# EAGLE design rpi-header-can-pwr (EAGLE 7.6.0)

## Sheet 1 of 6
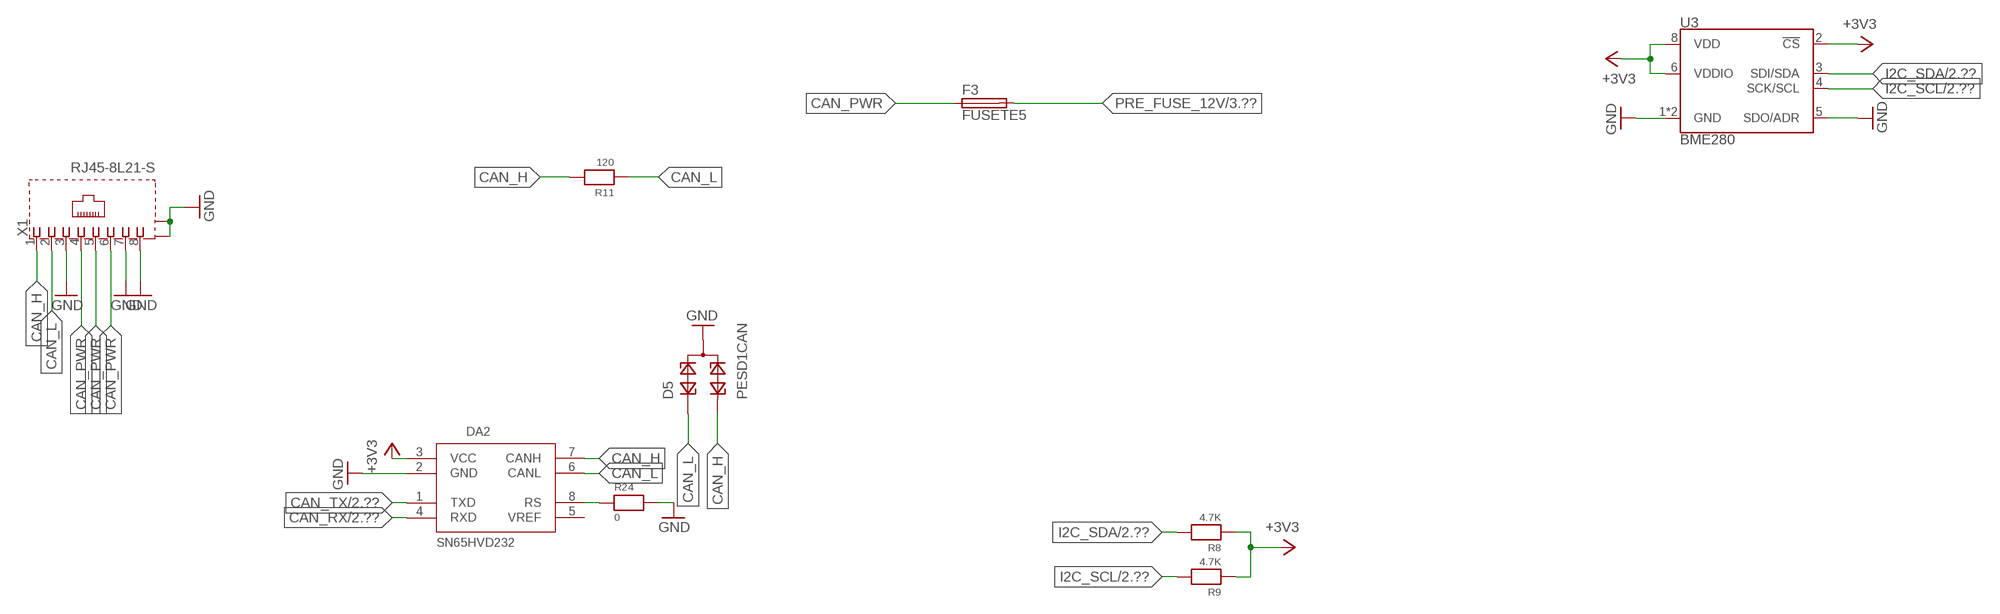
[diagram p0: schematic, sheet 1]

### Parts
D5  PESD1CAN  [SOT23]
DA2  SN65HVD232  [SO08]
F3  FUSETE5  [TE5]
R8  4.7K  RESISTOR0603  [0603]
R9  4.7K  RESISTOR0603  [0603]
R11  120  RESISTOR0603  [0603]
R24  0  RESISTOR0603  [0603]
U3  BME280  [LGA-8-2.5X2.5]
X1  RJ45-8L21-S  [RJ45-SHIELD1]

### Nets
+3V3: DA2.3(VCC) R8.1 R9.1 U3.2(!CS) U3.6(VDDIO) U3.8(VDD) ; also sheet 2,4,6
CAN_H: D5.2 DA2.7(CANH) R11.2 X1.1
CAN_L: D5.1 DA2.6(CANL) R11.1 X1.2
CAN_PWR: F3.1 X1.4 X1.5 X1.6
CAN_RX: DA2.4(RXD) ; also sheet 2
CAN_TX: DA2.1(TXD) ; also sheet 2
GND: D5.3 DA2.2(GND) R24.2 U3.1(GND) U3.5(SDO/ADR) U3.7(GND) X1.3 X1.7 X1.8 X1.S1(S) X1.S2(S) ; also sheet 2,3,4,5,6
I2C_SCL: R9.2 U3.4(SCK/SCL) ; also sheet 2,6
I2C_SDA: R8.2 U3.3(SDI/SDA) ; also sheet 2,6
N$17: DA2.8(RS) R24.1
PRE_FUSE_12V: F3.2 ; also sheet 3,5,6
Unconnected: DA2.5(VREF)

## Sheet 2 of 6
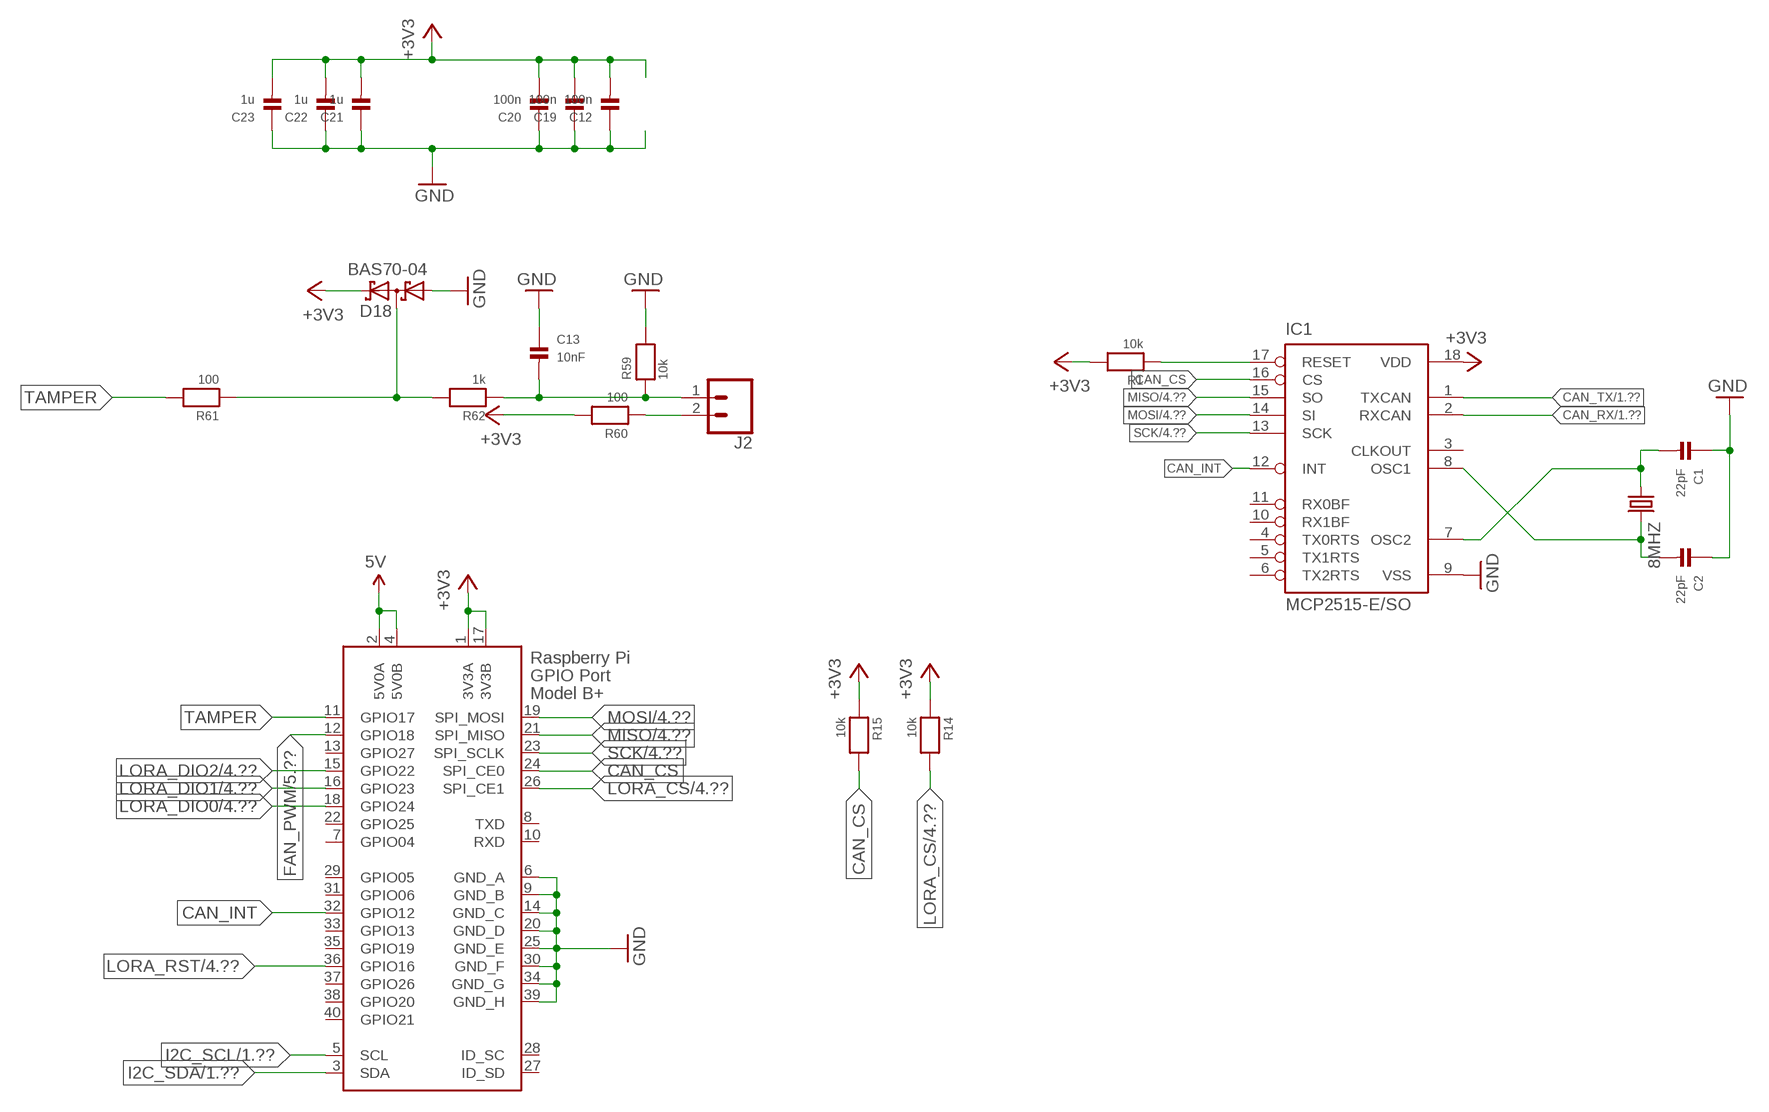
[diagram p1: schematic, sheet 2]

### Parts
8MHZ  CRYSTALHC49UP  [HC49UP]
C1  22pF  CAP_CERAMIC0603  [0603]
C2  22pF  CAP_CERAMIC0603  [0603]
C12  100n  CAP_CERAMIC0603  [0603]
C13  10nF  CAP_CERAMIC0603  [0603]
C19  100n  CAP_CERAMIC0603  [0603]
C20  100n  CAP_CERAMIC0603  [0603]
C21  1u  CAP_CERAMIC0603  [0603]
C22  1u  CAP_CERAMIC0603  [0603]
C23  1u  CAP_CERAMIC0603  [0603]
D18  BAS70-04  [SOT23]
IC1  MCP2515-E/SO  [SO18L]
J2  CONN_023.5MM  [SCREWTERMINAL-3.5MM-2]
R1  10k  RESISTOR0603  [0603]
R14  10k  RESISTOR0603  [0603]
R15  10k  RESISTOR0603  [0603]
R59  10k  RESISTOR0603  [0603]
R60  100  RESISTOR0603  [0603]
R61  100  RESISTOR0603  [0603]
R62  1k  RESISTOR0603  [0603]
X2  RASPI_BOARD_B+#_E3  [RASPI_BOARD_B+_EDGES_3DRILL]

### Nets
5V: X2.2(5V0A) X2.4(5V0B) ; also sheet 3
+3V3: C12.2 C19.2 C20.2 C21.2 C22.2 C23.2 D18.2(C2) IC1.18(VDD) R1.2 R14.1 R15.1 R60.2 X2.1(3V3A) X2.17(3V3B) ; also sheet 1,4,6
ASDASD: D18.3(C1A2) R61.1 R62.2
CAN_CS: IC1.16(CS) R15.2 X2.24(SPI_CE0)
CAN_INT: IC1.12(INT) X2.32(GPIO12)
CAN_RX: IC1.2(RXCAN) ; also sheet 1
CAN_TX: IC1.1(TXCAN) ; also sheet 1
FAN_PWM: X2.12(GPIO18) ; also sheet 5
GND: C1.1 C2.1 C12.1 C13.1 C19.1 C20.1 C21.1 C22.1 C23.1 D18.1(A1) IC1.9(VSS) R59.2 X2.6(GND_A) X2.9(GND_B) X2.14(GND_C) X2.20(GND_D) X2.25(GND_E) X2.30(GND_F) X2.34(GND_G) X2.39(GND_H) ; also sheet 1,3,4,5,6
I2C_SCL: X2.5(SCL) ; also sheet 1,6
I2C_SDA: X2.3(SDA) ; also sheet 1,6
LORA_CS: R14.2 X2.26(SPI_CE1) ; also sheet 4
LORA_DIO0: X2.18(GPIO24) ; also sheet 4
LORA_DIO1: X2.16(GPIO23) ; also sheet 4
LORA_DIO2: X2.15(GPIO22) ; also sheet 4
LORA_RST: X2.36(GPIO16) ; also sheet 4
MISO: IC1.15(SO) X2.21(SPI_MISO) ; also sheet 4
MOSI: IC1.14(SI) X2.19(SPI_MOSI) ; also sheet 4
N$2: 8MHZ.2 C2.2 IC1.8(OSC1)
N$3: 8MHZ.1 C1.2 IC1.7(OSC2)
N$10: J2.2 R60.1
N$11: C13.2 J2.1 R59.1 R62.1
RS: IC1.17(RESET) R1.1
SCK: IC1.13(SCK) X2.23(SPI_SCLK) ; also sheet 4
TAMPER: R61.2 X2.11(GPIO17)
Unconnected: IC1.3(CLKOUT) IC1.4(TX0RTS) IC1.5(TX1RTS) IC1.6(TX2RTS) IC1.10(RX1BF) IC1.11(RX0BF) X2.7(GPIO04) X2.8(TXD) X2.10(RXD) X2.13(GPIO27) X2.22(GPIO25) X2.27(ID_SD) X2.28(ID_SC) X2.29(GPIO05) X2.31(GPIO06) X2.33(GPIO13) X2.35(GPIO19) X2.37(GPIO26) X2.38(GPIO20) X2.40(GPIO21)

## Sheet 3 of 6
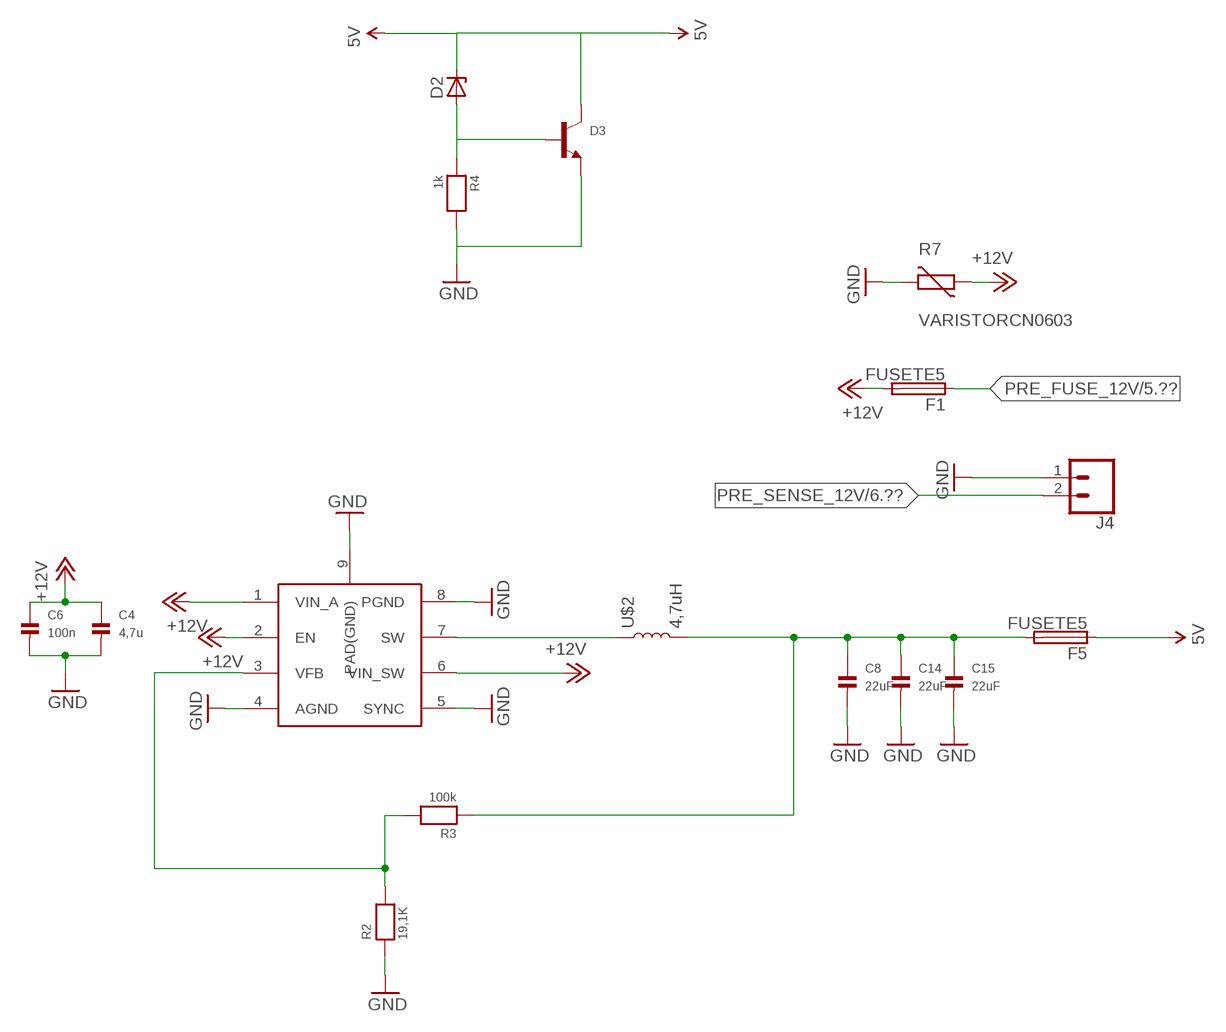
[diagram p2: schematic, sheet 3]

### Parts
C4  4,7u  CAP_CERAMIC0805  [0805]
C6  100n  CAP_CERAMIC0805  [0805]
C8  22uF  CAP_CERAMIC0805  [0805]
C14  22uF  CAP_CERAMIC0805  [0805]
C15  22uF  CAP_CERAMIC0805  [0805]
D2  ZENER-DIODESOD80C  [SOD80C]
D3  TRANSISTOR_NPNWIDE  [SOT23-WIDE]
F1  FUSETE5  [TE5]
F5  FUSETE5  [TE5]
J4  CONN_025MM  [SCREWTERMINAL-5MM-2]
R2  19,1K  RESISTOR0603  [0603]
R3  100k  RESISTOR0603  [0603]
R4  1k  RESISTOR0603  [0603]
R7  VARISTORCN0603  [CT/CN0603]
U$1  ST1S10  [POWERSO-8]
U$2  4,7uH  PCD0504MT4R7  [0504]

### Nets
5V: D2.C D3.3(C) F5.1 ; also sheet 2
+12V: C4.1 C6.1 F1.2 R7.1 U$1.1(VIN_A) U$1.2(EN) U$1.6(VIN_SW)
GND: C4.2 C6.2 C8.2 C14.2 C15.2 D3.2(E) J4.1 R2.1 R4.2 R7.2 U$1.4(AGND) U$1.5(SYNC) U$1.8(PGND) U$1.9(PAD(GND)) ; also sheet 1,2,4,5,6
N$1: R2.2 R3.2 U$1.3(VFB)
N$4: D2.A D3.1(B) R4.1
N$7: U$1.7(SW) U$2.1
N$8: C8.1 C14.1 C15.1 F5.2 R3.1 U$2.2
PRE_FUSE_12V: F1.1 ; also sheet 1,5,6
PRE_SENSE_12V: J4.2 ; also sheet 6

## Sheet 4 of 6
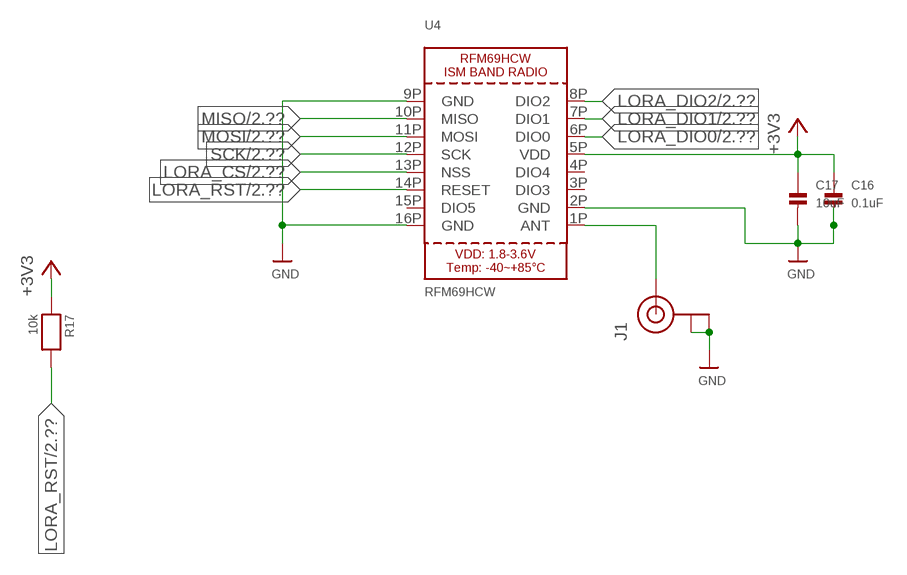
[diagram p3: schematic, sheet 4]

### Parts
C16  0.1uF  CAP_CERAMIC0603  [0603]
C17  10uF  CAP_CERAMIC0603  [0603]
J1  U.FL  [U.FL]
R17  10k  RESISTOR0603  [0603]
U4  RFM69HCW  RFM69HCW_SMT  [RFMHCW_SMT]

### Nets
+3V3: C16.1 C17.1 R17.1 U4.5P(VDD) ; also sheet 1,2,6
GND: C16.2 C17.2 J1.P$1(GND) J1.P$2(GND) U4.2P(GND) U4.9P(GND) U4.16P(GND) ; also sheet 1,2,3,5,6
LORA_CS: U4.13P(NSS) ; also sheet 2
LORA_DIO0: U4.6P(DIO0) ; also sheet 2
LORA_DIO1: U4.7P(DIO1) ; also sheet 2
LORA_DIO2: U4.8P(DIO2) ; also sheet 2
LORA_RST: R17.2 U4.14P(RESET) ; also sheet 2
MISO: U4.10P(MISO) ; also sheet 2
MOSI: U4.11P(MOSI) ; also sheet 2
N$5: J1.P$3(SIGNAL) U4.1P(ANT)
SCK: U4.12P(SCK) ; also sheet 2
Unconnected: U4.3P(DIO3) U4.4P(DIO4) U4.15P(DIO5)

## Sheet 5 of 6
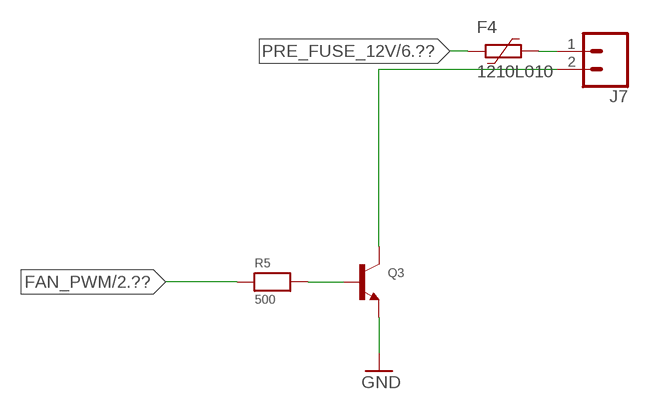
[diagram p4: schematic, sheet 5]

### Parts
F4  1210L010  [1210L]
J7  CONN_023.5MM  [SCREWTERMINAL-3.5MM-2]
Q3  TRANSISTOR_NPNWIDE  [SOT23-WIDE]
R5  500  RESISTOR0603  [0603]

### Nets
FAN_PWM: R5.1 ; also sheet 2
GND: Q3.2(E) ; also sheet 1,2,3,4,6
N$12: Q3.1(B) R5.2
N$13: F4.1 J7.1
N$14: J7.2 Q3.3(C)
PRE_FUSE_12V: F4.2 ; also sheet 1,3,6

## Sheet 6 of 6
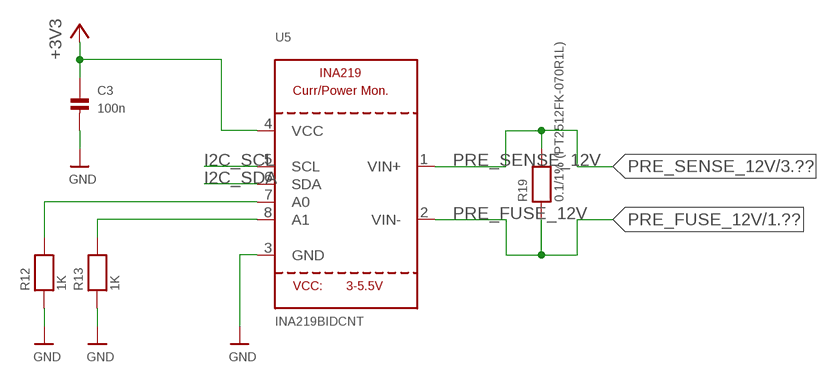
[diagram p5: schematic, sheet 6]

### Parts
C3  100n  CAP_CERAMIC0603  [0603]
R12  1K  RESISTOR0603  [0603]
R13  1K  RESISTOR0603  [0603]
R19  0.1/1% (PT2512FK-070R1L)  RESISTOR2512  [2512]
U5  INA219BIDCNT  INA219  [SOT23-8]

### Nets
+3V3: C3.1 U5.4(VCC) ; also sheet 1,2,4
GND: C3.2 R12.1 R13.1 U5.3(GND) ; also sheet 1,2,3,4,5
I2C_SCL: U5.5(SCL) ; also sheet 1,2
I2C_SDA: U5.6(SDA) ; also sheet 1,2
N$15: R13.2 U5.8(A1)
N$16: R12.2 U5.7(A0)
PRE_FUSE_12V: R19.1 U5.2(VIN-) ; also sheet 1,3,5
PRE_SENSE_12V: R19.2 U5.1(VIN+) ; also sheet 3

## Library data of the parts
8MHZ = crystal:CRYSTAL: CRYSTAL; OC_FARNELL: unknown; OC_NEWARK: unknown
C1-C4 C6 C8 C12-C17 C19-C23 = microbuilder:CAP_CERAMIC: Ceramic Capacitors 0402 - 0402 Surface Mount Capacitors 16pF 50V 5% [Digikey: 445-4899-2-ND] 18pF 50V 5% [Digikey: 490-1281-2-ND] 22pF 50V 5% [Digikey: 490-1283-2-ND] 68pF 50V 5% [Digikey: 490-1289-2-ND] 0.1uF 10V 10% [Digikey: 490-1318-2-ND] 1.0uF 6.3V 10% [Digikey: 490-1320-2-ND] 0603 - 0603 Surface Mount Capacitors 16 pF 50V 5% [Digikey: 445-5051-2-ND] 22 pF 50V [Digikey: PCC220ACVTR-ND] 33 pF 50V 5% [Digikey: 490-1415-1-ND] 56pF 50V 5% [Digikey: 490-1421-1-ND] 220pF 50V 5% [Digikey: 445-1285-1-ND] 680 pF 50V 2200 pF 50V 5% C0G [Digikey: 445-1297-1-ND] 5600 pF 100V 5% X7R [Digikey: 478-3711-1-ND] 0.1 µF 25V 10% [Digikey: PCC2277TR-ND] 0.22 µF 16V 10% X7R [Digikey: 445-1318-1-ND] 1.0 µF 25V 10% [Digikey: 445-5146-2-ND] 0603 - RF Specific 3pF 250V +/-0.1pF RF [Digikey: 712-1347-1-ND] 18 pF 250V 5% [Digikey: 478-3505-1-ND or 712-1322-1-ND] 56 pF 250V 5% C0G RF [Digikey: 490-4867-1-ND] 68 pF 250V RF [Digikey: 490-4868-1-ND] 0805 - 0805 Surface Mount Capacitors 220 pF 250V 2% RF Ceramic Capacitor [Digikey: 712-1398-1-ND] 1000 pF 50V 2% NP0 Ceramic Capacitor [Digikey: 478-3760-1-ND] 0.1 µF 25V 10% Ceramic Capacitor [Digikey: PCC1828TR-ND] 1.0 µF 16V 10% Ceramic Capacitor[Digikey: 490-1691-2-ND] 10.0 µF 10V 10% Ceramic Capacitor[Digikey: 709-1228-1-ND] 10.0 uF 16V 10% Ceramic Capacitor [Digikey: 478-5165-2-ND] 47 uF 6.3V 20% Ceramic Capacitor [Digikey: 587-1779-1-ND or 399-5506-1-ND] 1206 - 1206 Surface Mount Capacitors 47uF 10V 20% Ceramic Capacitor [Digikey: 490-5528-1-ND or 399-5508-1-ND or 445-6010-1-ND] 100uF 6.3V -20%, +80% Y5V Ceramic Capacitor (Digikey: 490-4512-1-ND, Mouser: 81-GRM31CF50J107ZE1L)
D2 = diode:ZENER-DIODE: Z-Diode
D3 Q3 = microbuilder:TRANSISTOR_NPN: NPN Transistor Transistor (NPN) 500mA 45V - BC817 [Digikey: 568-1631-1-ND] Transistor (NPN) 500mA 45V - BC817,215 [Mouser: 771-BC817-T/R] SOT23-R - SOT23 footprint optimised for use with solder paste and reflow ovens. SOT23-W - SOT23 footprint optimised for hand-soldering (larger pads).
D5 = diode:PESD1CAN: CAN bus ESD protection diode Source: http://www.nxp.com/documents/data_sheet/PESD1CAN.pdf
D18 = diode:BAS70-04: Silicon Schottky Diodes General-purpose diode for high-speed switching
DA2 = transceiver:SN65HVD232: CAN TRANSCEIVER
F1 F3 F5 = fuse:FUSE: Fuse; OC_FARNELL: unknown; OC_NEWARK: unknown
F4 = polyfuse-smd_10:?: Polyfuse Resettable PTC Source: http://www.littelfuse.com/products/resettable-ptcs.aspx; MF: Littelfuse; MPN: 1210L010; OC_FARNELL: 1822206; OC_NEWARK: 18M4781
IC1 = mcp2515:MCP2515
J1 = SparkFun-Connectors:U.FL: SMD Antenna Connector - U.FL 2mm height, 3.0mm x 3.0mm receptacle size. SparkFun Products: SparkFun WiFi Shield - ESP8266 <https://www.sparkfun.com/products/13287> SparkFun ESP8266 Thing <https://www.sparkfun.com/products/13231> SparkFun MiniGen - Pro Mini Signal Generator Shield <https://www.sparkfun.com/products/11420>; PROD_ID: CONN-09193; SF_ID: WRL-09144
J2 J7 = SparkFun-Connectors:CONN_02: Multi connection point. Often used as Generic Header-pin footprint for 0.1 inch spaced/style header connections On any of the 0.1 inch spaced packages, you can populate with these: Break Away Headers - Straight <https://www.sparkfun.com/products/116> (PRT-00116) Break Away Male Headers - Right Angle <https://www.sparkfun.com/products/553> (PRT-00553) Female Headers <https://www.sparkfun.com/products/115> (PRT-00115) Break Away Headers - Machine Pin <https://www.sparkfun.com/products/117> (PRT-00117) Break Away Female Headers - Swiss Machine Pin <https://www.sparkfun.com/products/743> (PRT-00743) For SCREWTERMINALS and SPRING TERMINALS visit here: Screw Terimnals on SparkFun.com <https://www.sparkfun.com/search/results?term=Screw+Terminals> (5mm/3.5mm/2.54mm spacing) This device is also useful as a general connection point to wire up your design to another part of your project. Our various solder wires solder well into these plated through hole pads. Hook-Up Wire - Assortment (Stranded, 22 AWG) <https://www.sparkfun.com/products/11375> (PRT-11375) Hook-Up Wire - Assortment (Solid Core, 22 AWG) <https://www.sparkfun.com/products/11367> (PRT-11367) View the entire wire category on our website here <https://www.sparkfun.com/categories/141> Special notes: Molex polarized connector foot print use with: PRT-08233 with associated crimp pins and housings. 2.54_SCREWTERM for use with PRT-10571. 3.5mm Screw Terminal footprints for PRT-08084 5mm Screw Terminal footprints for use with PRT-08432; PROD_ID: CONN-08399
J4 = SparkFun-Connectors:CONN_02: Multi connection point. Often used as Generic Header-pin footprint for 0.1 inch spaced/style header connections On any of the 0.1 inch spaced packages, you can populate with these: Break Away Headers - Straight <https://www.sparkfun.com/products/116> (PRT-00116) Break Away Male Headers - Right Angle <https://www.sparkfun.com/products/553> (PRT-00553) Female Headers <https://www.sparkfun.com/products/115> (PRT-00115) Break Away Headers - Machine Pin <https://www.sparkfun.com/products/117> (PRT-00117) Break Away Female Headers - Swiss Machine Pin <https://www.sparkfun.com/products/743> (PRT-00743) For SCREWTERMINALS and SPRING TERMINALS visit here: Screw Terimnals on SparkFun.com <https://www.sparkfun.com/search/results?term=Screw+Terminals> (5mm/3.5mm/2.54mm spacing) This device is also useful as a general connection point to wire up your design to another part of your project. Our various solder wires solder well into these plated through hole pads. Hook-Up Wire - Assortment (Stranded, 22 AWG) <https://www.sparkfun.com/products/11375> (PRT-11375) Hook-Up Wire - Assortment (Solid Core, 22 AWG) <https://www.sparkfun.com/products/11367> (PRT-11367) View the entire wire category on our website here <https://www.sparkfun.com/categories/141> Special notes: Molex polarized connector foot print use with: PRT-08233 with associated crimp pins and housings. 2.54_SCREWTERM for use with PRT-10571. 3.5mm Screw Terminal footprints for PRT-08084 5mm Screw Terminal footprints for use with PRT-08432; SF_SKU: PRT-08432
R1-R5 R8 R9 R11-R15 R17 R19 R24 R59-R62 = microbuilder:RESISTOR: Resistors 0402 - 0402 Surface Mount Package 22 Ohm 1% 1/16W [Digikey: 311-22.0LRTR-ND] 33 Ohm 5% 1/16W 1.0K 5% 1/16W 1.5K 5% 1/16W 2.0K 1% 1/16W 10.0K 1% 1/16W [Digikey: 311-10.0KLRTR-ND] 10.0K 5% 1/16W [Digikey: RMCF0402JT10K0TR-ND] 12.1K 1% 1/16W [Digikey: 311-22.0LRTR-ND] 100.0K 5% 1/16W 0603 - 0603 Surface Mount Package 0 Ohm 1/10 Watt 1% Resistor 15 Ohm 1/10 Watt 1% Resistor 33 Ohm 1/10 Watt 1% Resistor 49.9 Ohm 1/10 Watt 1% Resistor 100 Ohm 1/10 Watt 1% Resistor 150 Ohm 1/10 Watt 1% Resistor 240 Ohm 1/10 Watt 1% Resistor 390 Ohm 1/10 Watt 1% Resistor 560 Ohm 1/10 Watt 1% Resistor 680 Ohm 1/10 Watt 1% Resistor 750 Ohm 1/10 Watt 1% Resistor 1.0K Ohm 1/10 Watt 1% Resistor 1.5K Ohm 1/10 Watt 1% Resistor 2.0K Ohm 1/10 Watt 1% Resistor 2.2K Ohm 1/10 Watt 1% Resistor 3.3K Ohm 1/10 Watt 1% Resistor 4.7K Ohm 1/10 Watt 1% Resistor 10.0K Ohm 1/10 Watt 1% Resistor 12.0K Ohm 1/10 Watt 1% Resistor 12.1K Ohm 1/10 Watt 1% Resistor 20.0K Ohm 1/10 Watt 1% Resistor 33.0K Ohm 1/10 Watt 1% Resistor 100.0K Ohm 1/10 Watt 1% Resistor 0805 - 0805 Surface Mount Package 0 Ohm 1/8 Watt 1% Resistor 33 Ohm 1/8 Watt 1% Resistor 100 Ohm 1/8 Watt 1% Resistor 150 Ohm 1/8 Watt 1% Resistor 200 Ohm 1/8 Watt 1% Resistor 240 Ohm 1/8 Watt 1% Resistor 330 Ohm 1/8 Watt 1% Resistor 390 Ohm 1/8 Watt 1% Resistor 470 Ohm 1/8 Watt 1% Resistor 1.0K Ohm 1/8 Watt 1% Resistor 1.5K Ohm 1/8 Watt 1% Resistor 2.0K Ohm 1/8 Watt 1% Resistor 4.7K Ohm 1/8 Watt 1% Resistor 5.1K Ohm 1/8 Watt 1% Resistor 5.6K Ohm 1/8 Watt 1% Resistor 10.0K Ohm 1/8 Watt 1% Resistor 22.0K Ohm 1/8 Watt 1% Resistor 33.0K Ohm 1/8 Watt 1% Resistor 100K Ohm 1/8 Watt 1% Resistor 1206 - 1206 Surface Mount Package 2012 - 2010 Surface Mount Package 0.11 Ohm 1/2 Watt 1% Resistor - Digikey: RHM.11UCT-ND
R7 = varistor:VARISTOR: VARISTOR
U3 = SparkFun-Sensors:BME280: Bosch BME280 – Combined Humidity and Pressure Sensor The BME280 is as combined digital humidity, pressure and temperature sensor based on proven sensing principles. The sensor module is housed in an extremely compact metal-lid LGA package with a footprint of only 2.5×2.5mm² with a height of 0.93mm. Its small dimensions and its low power consumption allow the implementation in battery driven devices such as handsets, GPS modules or watches. Datasheet <https://cdn.sparkfun.com/assets/learn_tutorials/4/1/9/BST-BME280_DS001-10.pdf> SparkFun Products SparkFun Atmospheric Sensor Breakout - BME280 <https://www.sparkfun.com/products/13676> (SEN-13676); PROD_ID: IC-13090
U4 = microbuilder:RFM69HCW: RFM69HCW - ISM Band RF Transceiver
U5 = microbuilder:INA219: INA219 - I2C Current/Power Monitor Voltage Range: 0-26V Accuracy: 0.5% Temperature: -40°C - 125°C
U$1 = lcd:ST1S10
U$2 = lcd:PCD0504MT4R7
X1 = con-tycoelectronics:RJ45*2: RJ45 Low Profile Shield Type 2 For all RJ45 L, LC, LCT and X Series Models Source: www.tycoelectronics.com .. ENG_DS_1654001_1099_RJ_L_0507.pdf; OC_FARNELL: unknown; OC_NEWARK: unknown
X2 = raspberrypi_bastelstube_v13:RASPI_BOARD_B+#: Raspberry Pi GPIO connector with markings for the outer dimensions of the Raspberry Pi board model B+ with different sets of drill holes or mounting pads All pins connected

## Board
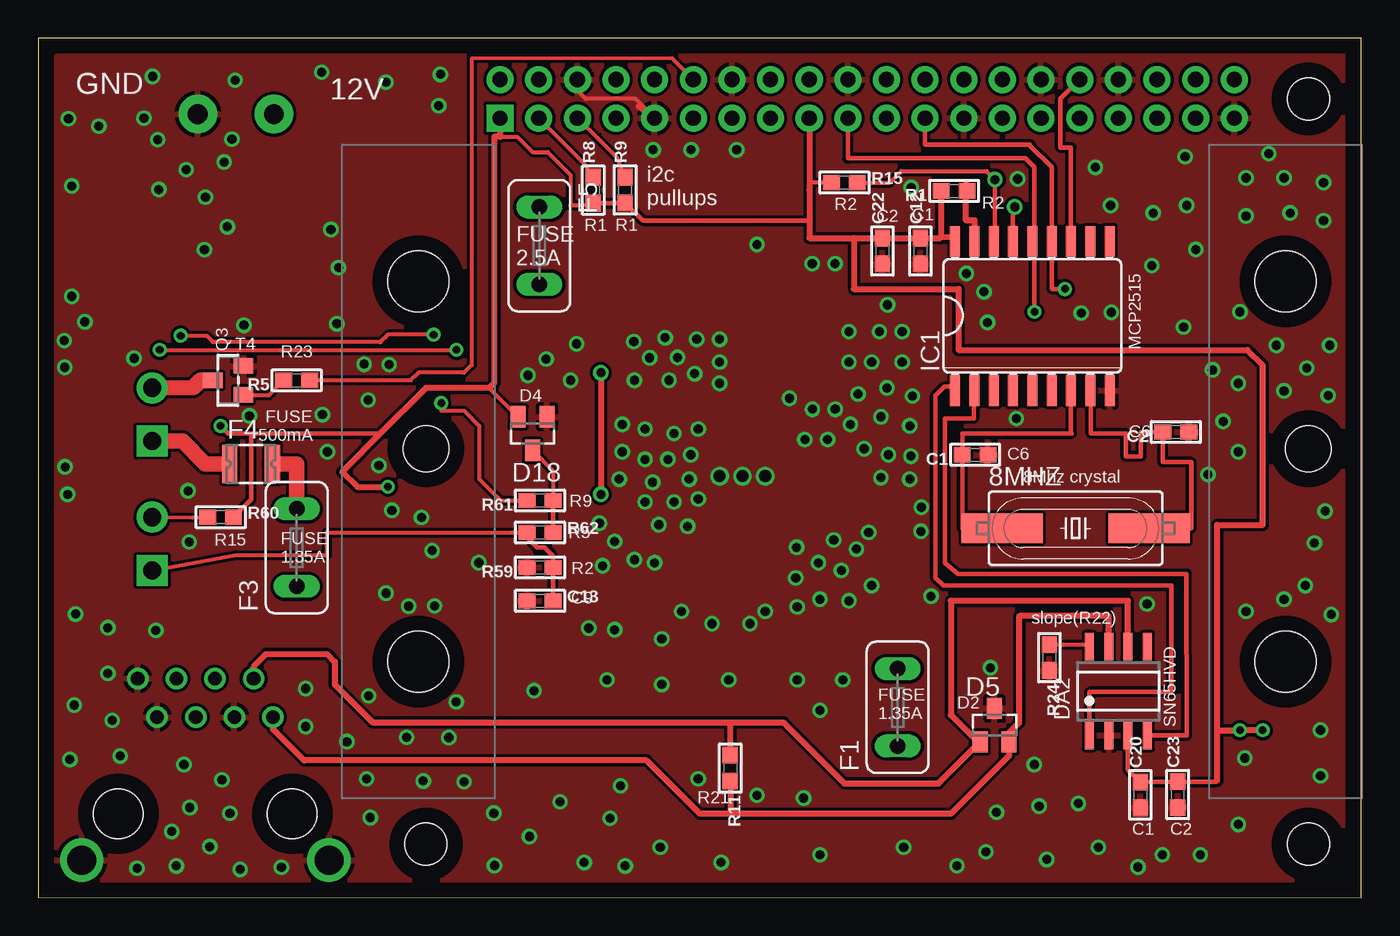
[diagram p6: board, top side]
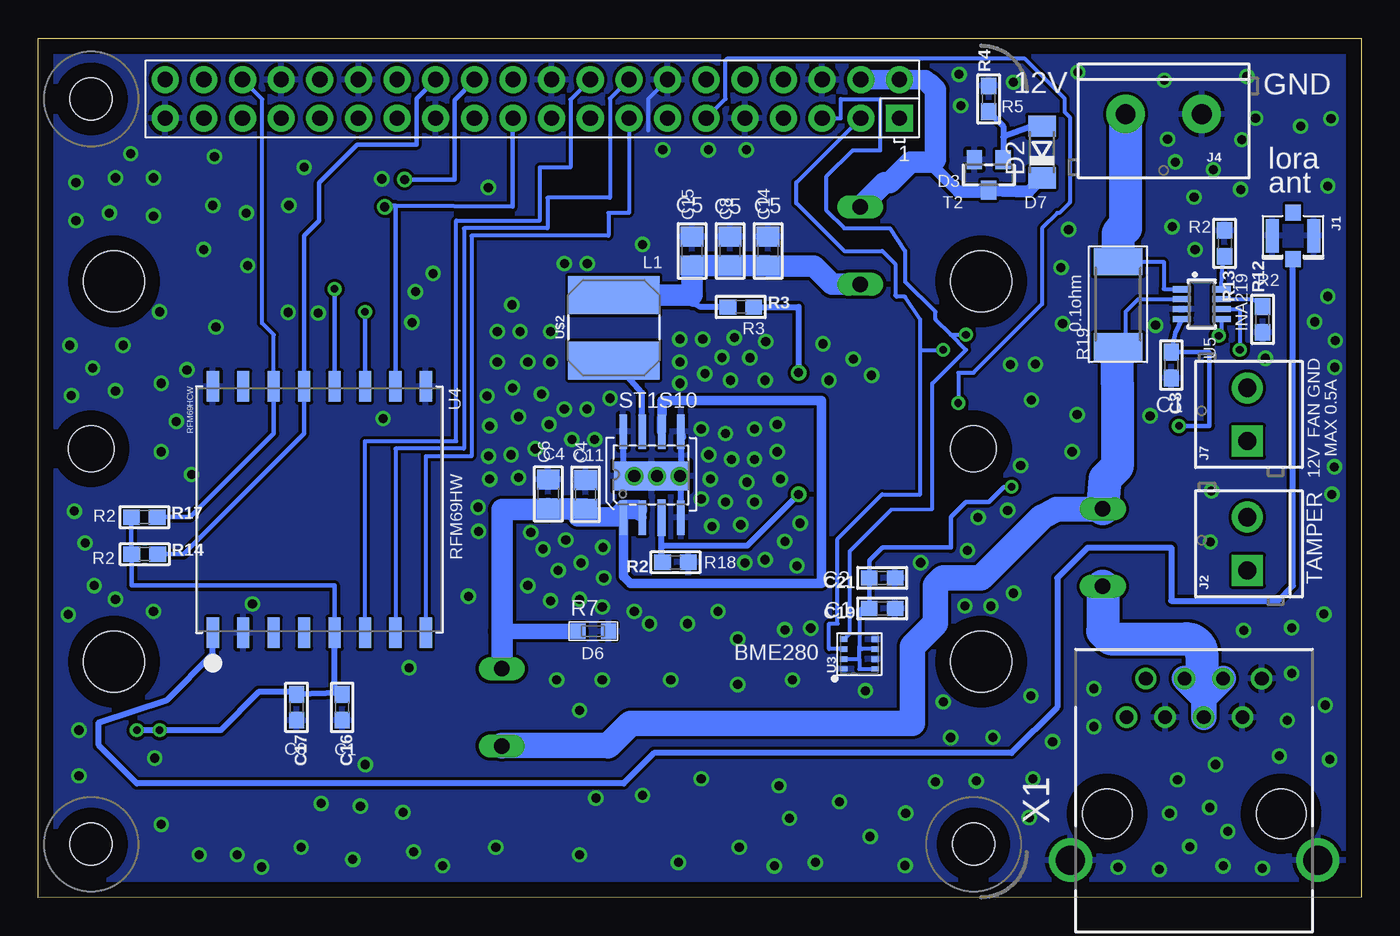
[diagram p7: board, bottom side, seen from below]

Size 86.99 x 56.52 mm. Coordinates in mm from the lower left corner, seen from the top.
Outline: 0,0.02 86.99,0 86.99,56.52 0,56.52 0,0.02
Copper layers (1*16): Top 0.035mm / dielectric 1.5mm / Bottom 0.035mm
Design rules "default *": minimum track width 10mil, minimum drill 0.4mm, track to track 8mil, track to pad 8mil, pad to pad 8mil, via to via 8mil, smd to smd 8mil, copper to edge 40mil, drill to drill 8mil, minimum pad ring 10mil, minimum via ring 8mil, stop-mask expansion 4mil, vias tented up to drill 0mil, thermal gap 10mil
Holes 3 mm at 83.5,29.52 25.5,29.52

### Footprints (pad centres in the part's own frame; a part is rotated, then mirrored left to right if it is on the bottom)
HC49UP = smd 5.334 x 1.93: 1 -4.826,0; 2 4.826,0
0603 = smd 1.1 x 1: 1 -0.85,0; 2 0.85,0
0805 = smd 1.3 x 1.5: 1 -0.95,0; 2 0.95,0
SOD80C = smd 1.4 x 1.8: A 1.7,0; C -1.7,0
SOT23-WIDE = smd 1 x 1.27: 1 -0.95,-1; 2 0.95,-1; 3 0,1
SOT23 = smd 1 x 1.4: 1 -0.95,-1.1; 2 0.95,-1.1; 3 0,1.1
SO08 = smd 0.6 x 1.8: 1 -1.905,-2.917; 2 -0.635,-2.917; 3 0.635,-2.917; 4 1.905,-2.917; 5 1.905,2.917; 6 0.635,2.917; 7 -0.635,2.917; 8 -1.905,2.917
TE5 = drill 1.016 long: 1 -2.54,0; 2 2.54,0
1210L = smd 1 x 2.5: 1 -1.4,0; 2 1.4,0
SO18L = smd 0.66 x 2.032: 1 -5.08,-4.902; 2 -3.81,-4.902; 3 -2.54,-4.902; 4 -1.27,-4.902; 5 0,-4.902; 6 1.27,-4.902; 7 2.54,-4.902; 8 3.81,-4.902; 9 5.08,-4.902; 10 5.08,4.902; 11 3.81,4.902; 12 2.54,4.902; 13 1.27,4.902; 14 0,4.902; 15 -1.27,4.902; 16 -2.54,4.902; 17 -3.81,4.902; 18 -5.08,4.902
U.FL = smd 2.2 x 0.85: P$1 0,1.375; P$2 0,-1.375 | smd 1.05 x 1: P$3 1.525,0; P$4 -1.525,0
SCREWTERMINAL-3.5MM-2 = drill 1.2 pad 2.032 square: 1 0,0 | drill 1.2 pad 2.032: 2 3.5,0
SCREWTERMINAL-5MM-2 = drill 1.3 pad 2.54: 1 0,0; 2 5,0
CT/CN0603 = smd 1 x 1: 1 -1,0; 2 1,0
2512 = smd 1.8 x 3.2: 1 -2.8,0; 2 2.8,0
LGA-8-2.5X2.5 = smd 0.35 x 0.5: 1 -0.975,1.025; 2 -0.325,1.025; 3 0.325,1.025; 4 0.975,1.025; 5 0.975,-1.025; 6 0.325,-1.025; 7 -0.325,-1.025; 8 -0.975,-1.025
RFMHCW_SMT = smd 2 x 0.8: 1P 8.1,-7; 2P 8.1,-5; 3P 8.1,-3; 4P 8.1,-1; 5P 8.1,1; 6P 8.1,3; 7P 8.1,5; 8P 8.1,7; 9P -8.1,7; 10P -8.1,5; 11P -8.1,3; 12P -8.1,1; 13P -8.1,-1; 14P -8.1,-3; 15P -8.1,-5; 16P -8.1,-7
SOT23-8 = smd 0.4 x 1.2: 1 -0.975,-1.3; 2 -0.325,-1.3; 3 0.325,-1.3; 4 0.975,-1.3; 5 0.975,1.3; 6 0.325,1.3; 7 -0.325,1.3; 8 -0.975,1.3
POWERSO-8 = smd 0.5 x 2.286: 1 -1.879,-2.754 | smd 0.5 x 2.278: 2 -0.625,-2.754; 4 1.913,-2.754; 5 1.918,2.904; 6 0.649,2.904; 7 -0.626,2.904; 8 -1.879,2.904 | smd 0.5 x 2.378: 3 0.644,-2.754 | smd 4.953 x 1.905: 9 0,0
0504 = smd 2.5 x 6: 1 -2.175,0; 2 2.125,0
C45-DIN-MOUNT-2-HOLE = hole 4: 0,12.5; 0,-12.5
RJ45-SHIELD1 = drill 0.9 pad 1.4: 1 -4.445,6.35; 2 -3.175,8.89; 3 -1.905,6.35; 4 -0.635,8.89; 5 0.635,6.35; 6 1.905,8.89; 7 3.175,6.35; 8 4.445,8.89 | drill 1.9 pad 2.5: S1 -8.128,-3.048; S2 8.128,-3.048 | hole 3.251: -5.715,0; 5.715,0
RASPI_BOARD_B+_EDGES_3DRILL = drill 1 pad 1.778 square: 1 8.37,51.23 | drill 1 pad 1.778: 2 8.37,53.77; 3 10.91,51.23; 4 10.91,53.77; 5 13.45,51.23; 6 13.45,53.77; 7 15.99,51.23; 8 15.99,53.77; 9 18.53,51.23; 10 18.53,53.77; 11 21.07,51.23; 12 21.07,53.77; 13 23.61,51.23; 14 23.61,53.77; 15 26.15,51.23; 16 26.15,53.77; 17 28.69,51.23; 18 28.69,53.77; 19 31.23,51.23; 20 31.23,53.77; 21 33.77,51.23; 22 33.77,53.77; 23 36.31,51.23; 24 36.31,53.77; 25 38.85,51.23; 26 38.85,53.77; 27 41.39,51.23; 28 41.39,53.77; 29 43.93,51.23; 30 43.93,53.77; 31 46.47,51.23; 32 46.47,53.77; 33 49.01,51.23; 34 49.01,53.77; 35 51.55,51.23; 36 51.55,53.77; 37 54.09,51.23; 38 54.09,53.77; 39 56.63,51.23; 40 56.63,53.77 | hole 2.75: 3.5,3.5; 61.5,3.5; 61.5,52.5

### Placement (x,y rotation side)
8MHZ  68.2,24.29 0 top
C1  61.6,29.12 180 top
C2  74.79,30.62 180 top
C3  12.5,35.02 270 bottom
C4  51,26.52 90 bottom
C6  53.45,26.55 90 bottom
C8  41.5,42.52 90 bottom
C12  58,42.52 90 top
C13  33,19.52 0 top
C14  39,42.52 90 bottom
C15  44,42.52 90 bottom
C16  67,12.52 270 bottom
C17  70,12.52 270 bottom
C19  31.5,19.02 180 bottom
C20  72.45,6.76 90 top
C21  31.5,21.02 180 bottom
C22  55.5,42.52 90 top
C23  74.91,6.78 90 top
D2  21,49.02 90 bottom
D3  24.5,47.52 180 bottom
D5  62.87,11.35 0 top
D18  32.5,30.52 180 top
DA2  71.01,13.58 0 top
F1  56.5,12.52 90 top
F3  17,23.02 90 top
F4  14,28.52 0 top
F5  32.95,42.87 270 top
IC1  65.36,38.25 0 top
J1  4.5,43.52 270 bottom
J2  7.5,21.52 90 bottom
J4  10.5,51.52 180 bottom
J7  7.5,30.02 90 bottom
Q3  12.5,34.02 90 top
R1  60.22,46.47 180 top
R2  45.09,22.06 180 bottom
R3  40.8,38.84 0 bottom
R4  24.5,52.52 90 bottom
R5  17,34.02 180 top
R7  50.5,17.52 0 bottom
R8  36.5,46.52 90 top
R9  38.59,46.53 90 top
R11  45.5,8.52 270 top
R12  6.5,38.02 90 bottom
R13  9,43.02 270 bottom
R14  79.98,22.59 0 bottom
R15  53,47.02 0 top
R17  80,25.02 0 bottom
R19  16,39.02 90 bottom
R24  66.47,15.79 270 top
R59  33,21.72 180 top
R60  12,25.02 0 top
R61  33,26.12 180 top
R62  33,24.02 0 top
U3  33,16.02 90 bottom
U4  68.5,25.52 270 bottom
U5  10.5,39.02 270 bottom
U$1  46.65,27.74 0 bottom
U$2  49.15,37.5 90 bottom
U$3  [C45-DIN-MOUNT-2-HOLE]  82,28.02 0 bottom
U$4  [C45-DIN-MOUNT-2-HOLE]  25,28.02 0 bottom
X1  11,5.52 0 bottom
X2  22,0.02 0 top

### Tracks (layer width: path | path; a pad name or v marks a point on that pad's centre or on a via)
5V
  Bottom 0.61: 24.6,46.42 D3.3
  Bottom 0.813: D3.3 21.9,46.42 D2.C | 24.6,46.42 26.5,46.42 28.44,48.36
  Bottom 1.27: 28.4,53.52 28.67,53.79 X2.2 X2.4
  Bottom 1.422: 28.4,53.52 28,53.12 28,48.52 28.44,48.36 29.66,48.36 31,47.02 31.34,47.02 F5.1
+3V3  (via drill 0.5)
  Top 0.254: R15.1 50.7,47.02 50.7,46.52 | 30.37,50.02 31.5,50.02 32.5,49.02 33.5,49.02 35,47.52 35,45.52 35.85,45.52 R8.1 | D18.2 29.65,33.52
  Top 0.305: R8.1 R9.1 39.75,44.52 50.7,44.52 | 14,30.52 12.5,30.52 v12,31.02 | 14,30.52 22.5,30.52 | R60.2 14,26.17 14,30.52 | 71.64,9.74 71.64,8.41 C20.2 74.89,7.61 C23.2 77.44,7.63 77.5,7.69 | 60.11,43.39 60.11,43.32 IC1.18
  Top 0.406: 60.11,43.39 59.37,43.43 | 59.37,43.43 R1.2 | X2.17 50.7,46.52 50.7,44.52 50.7,43.38 53.63,43.38 | DA2.3 71.64,9.74 | 77.5,7.69 77.5,11.02 | 77.5,11.02 77.5,24.52 80.5,24.52 80.5,35.02 79.5,36.02 60.5,36.02 60.5,40.02 53.63,40.02 53.63,43.38 | X2.1 30.37,50.02 30,50.02 30,33.87 29.65,33.52 25.5,33.52 22.5,30.52 20.15,28.17 19.99,27.98 21,27.02 v23,27.02 | 77.5,11.02 v79,11.02 v80.5,11.02 | 53.63,43.38 C22.2 C12.2 59.31,43.37 59.37,43.43
  Bottom 0.254: U3.2 33,15.7 | 33,15.7 33,16.52 | 33,15.7 33,15.04 U3.8 | U3.6 32.83,16.34 arc90 33,16.52 | 33,18.84 33,16.52 | 11.5,38.05 U5.4
  Bottom 0.305: v23,27.02 23.5,27.02 24.5,26.02 26,26.02 27,25.02 27,23.02 31.5,23.02 32.35,22.17 C21.2 C19.2 32.82,19.02 33,18.84 | R17.1 80.85,22.59 R14.1 80.83,20.52 67.5,20.52 U4.5P | v12,31.02 10,31.02 10,35.87 C3.1 12.25,37.12 U5.4
  Bottom 0.406: v80.5,11.02 v79,11.02 75,11.02 72.5,13.52 70.05,13.52 C17.1 67.1,13.47 C16.1 67.5,13.87 U4.5P
+12V
  Bottom 0.406: 51.73,25.49 U$1.1 48.5,25.52
  Bottom 0.61: U$1.6 45.99,32.68 35.5,32.69 35.5,20.66 48.05,20.66 48.5,21.12 48.5,25.52 U$1.2
  Bottom 1.016: R7.1 56.5,17.52
  Bottom 1.27: 51,25.52 51.5,25.02 49,25.02 48.5,25.52 47.6,25.52
  Bottom 1.422: F1.2 56.5,17.52 56.5,25.52 53.45,25.52 C6.1 53.45,25.57 C4.1 51,25.52
ASDASD
  Top 0.254: D18.3 33.85,28.07 R61.1
  Top 0.305: R61.1 R62.2
CAN_CS  (via drill 0.6)
  Top 0.254: R15.2 56,47.02 56.75,47.77 62.35,47.77 v62.9,47.22
  Top 0.305: 62.9,43.42 v62.9,47.22 | 62.9,43.18 62.9,43.42 | 62.9,43.42 63,43.52 63,43.33 IC1.16
  Bottom 0.305: X2.24 59.6,52.42 59.6,47.22 v62.9,47.22
CAN_H
  Top 0.406: DA2.7 70.38,18.52 64.5,18.52 64.5,11.52 63.82,10.84 D5.2 63.82,9.34 60,5.52 45.5,5.52 | 45.5,5.52 43.5,5.52 40,9.02 17.5,9.02 15.45,11.07 X1.1 | R11.2 45.5,5.52
CAN_INT
  Top 0.305: IC1.12 67.9,49.32 67.2,49.32 67.2,52.52 X2.32
CAN_L
  Top 0.406: DA2.6 71.64,19.52 60,19.52 60,12.02 61.77,10.25 D5.1 59.19,7.52 53,7.52 49,11.52 45.5,11.52 | 45.5,11.52 22,11.52 19.5,14.02 19.5,15.52 19,16.02 15,16.02 14.18,15.2 X1.2 | R11.1 45.5,11.52
CAN_PWR
  Bottom 1.016: 10.5,14.02 arc-90 10.62,13.9 10.62,13.4
  Bottom 1.676: X1.5 10.37,13.14 | 10.37,13.14 X1.6 | 10.37,13.14 10.62,13.4 X1.4
  Bottom 2.184: F3.1 17,17.52 16.5,17.02 11.5,17.02 arc90 10.5,16.02 10.5,14.02
CAN_RX
  Top 0.305: DA2.4 75.5,10.66 75.48,21.3 60.48,21.3 59.61,22.02 59.61,31.52 61.5,31.52 61.5,33.02 | 61.5,33.51 61.5,33.02 | IC1.2 61.55,33.07 61.5,33.02
CAN_TX
  Top 0.305: DA2.1 69.11,13.52 74.5,13.52 74.5,20.52 59.5,20.52 59,21.02 59,33.02 59.58,33.6 60.03,33.6 IC1.1
  Top 0.406: 69.11,11.62 DA2.1
FAN_PWM
  Top 0.254: X2.12 41.68,55.18 28.5,55.15 28.5,51.97 28.5,51.94 28.5,35.02 28,34.52 25,34.52 24.5,34.02 R5.1
GND  (via drill 0.6, 0.8)
  Top 0.254: X2.9 39.26,52.52 36,52.52 35.45,53.07 X2.6
  Top 0.406: X2.9 39.5,52.02
  Bottom 0.254: X2.14 46.89,52.51 46.89,50.45
  Bottom 0.406: U$1.8 48.53,27.74 U$1.9 | U$1.9 44.73,27.74 U$1.5 44.59,30.28 | U$1.4 44.74,27.74 U$1.9
  other vias: 26.45,54.13 29.96,5.56 21.7,32.72 2.22,46.79 80.9,48.92 9.93,23.39 75.5,45.52 84.5,47.02 70.5,45.52 69.5,48.02 83.9,23.32 47.26,42.95 41,17.02 39.2,22.22 36.2,17.72 84.3,11.02 32.3,4.02 26.07,19.18 37.6,5.22 39.9,26.02 35,34.02 40.43,49.17 64.39,47.26 27,10.53 54.8,20.52 26.34,52.07 28,7.62 25.9,22.82 37.9,23.42 40.4,27.32 21.6,7.82 20.3,10.26 43.16,34.45 2.47,18.65 18.64,54.27 7.53,53.99 46.3,27.72 44.8,27.72 42.9,29.12 51.9,30.12 49.39,32.84 44.8,33.82 41.48,34.02 39.2,34.02 47.8,27.72 42.7,24.42 43.4,26.22 6.31,35.46 41.22,36.82 39.16,36.56 84.3,8.02 69.7,3.32 58.7,19.82 41.4,28.82 39.9,30.82 43.4,30.82 38.4,31.12 38.2,27.52 40.8,24.52 36.9,24.62 37.1,21.82 40.53,22.02 42.3,18.82 75.4,48.72 81.9,19.62 41.8,26.02 42.8,27.52 41.8,30.52 49.86,23.04 49.8,21.02 51.3,22.02 52.3,23.52 52.8,21.52 53.8,22.92 50.4,30.12 50.9,32.12 52.4,32.12 53.4,31.12 53.9,33.12 55.4,31.62 55.9,29.12 55.4,27.62 51.4,19.62 49.9,19.12 37.9,17.62 39.9,28.82 38.4,29.32 47.8,18.82 84.8,33.02 57.3,27.52 57.3,31.02 54.3,29.52 55.8,33.52 40.2,35.5 43.3,36.72 44.8,36.72 44.8,35.22 42.03,35.52 53.3,37.22 55.3,37.22 56.8,37.22 56.8,35.22 54.8,35.22 53.3,35.22 57.47,32.98 46.8,18.02 53.3,19.52 44.3,18.02 58.03,24.09 57.37,29.03 76.1,42.62 83.3,20.52 84.6,25.42 72.3,2.02 62.3,3.02 77.2,34.7 68.57,38.44 75.3,37.52 73.3,45.02 82.3,45.02 58.06,25.67 54.6,24.02 62.6,15.12 9.86,26.75 32.2,34.35 22.4,28.42 22.87,20.02 25.32,7.68 66.3,2.52 65.8,6.02 62.18,39.84 2,51.22 1.72,36.63 25.2,25 7.94,46.56 11,46.06 7.86,49.84 12.24,48.37 44.9,2.32 40.9,3.32 51.4,2.82 47.26,6.73 43.4,7.82 56.9,3.32 35.9,2.32 37.4,14.32 21.73,13.27 24.23,10.54 32.61,13.61 45.4,14.32 49.9,14.32 52.9,14.32 6.51,1.94 11.29,3.36 21.84,5.27 28.97,22.03 5.4,9.32 2.38,12.66 24.36,19.17 18.69,31.76 27.49,12.88 79.4,18.82 65.48,8.75 76.4,2.82 78.9,4.82 79.32,9.18 79.4,47.32 81.9,47.32 79.4,44.82 73.21,41.56 83.4,34.82 84.9,36.32 81.4,36.32 81.9,33.32 77.9,31.32 57.39,46.69 64.31,31.5 78.9,33.82 78.9,29.32 72.9,19.32 76.9,27.82 51.4,12.32 50.32,6.55 68.38,6.2 73.9,2.82 60.4,2.1 62.41,37.82 22.87,53.62 23.26,25.47 41,14.02 4,50.72 30,2.12 63,5.62 85,18.62 84.5,44.52 79,38.52 35.4,36.42 33.4,35.42 1.94,26.52 2.09,9.09 7.74,17.57 34.31,6.31 12.61,5.55 9.98,5.93 9.09,2.09 38.59,2.09 4.59,17.75 8.79,4.36 13.29,1.86 38.29,7.36 16,2 50.89,41.69 52.39,41.69 70.55,38.49 55.84,38.98 42.93,49.17 45.93,49.17 6.96,51.25 12.96,53.75 3.08,37.86 2.21,39.54 1.75,34.87 13.89,31.68 13.53,37.64 12.44,44.11 19.64,37.74 19.75,41.43 21.43,35.08 19.02,29.32 1.78,28.33 61.02,41.04 4.59,14.75 17.59,11.25 17.59,13.75 12.09,7.75 9.74,47.87 12.74,49.87 9.59,8.75 4.88,11.66 23.08,35.05 19.25,43.93 10.94,42.61
  pour Top: 0,51.02 0,0.72 arc90 1.2,0.02 84,0.02 arc90 87,3.02 87,53.52 arc90 84,56.52 3.5,56.52 arc90
  pour Bottom: 0,53.02 0,2.72 arc90 1.2,0.02 84,0.02 arc90 87,3.02 87,53.52 arc90 84,56.52 3,56.52 arc90
I2C_SCL  (via drill 0.5)
  Top 0.254: R9.2 38.09,48.61 X2.5 | v9.38,36.95 11.07,36.95 11.5,36.52 22.5,36.52 23,37.02 v26,37.02
  Bottom 0.254: U3.4 33.63,17.39 33.63,22.79 30.9,25.52 28.21,25.57 28.21,33.81 26,36.02 27,37.02 | X2.5 34.23,51.25 34.23,52.51 31.64,52.51 31.64,49.13 33.45,49.13 35.19,47.39 35.19,45.21 34,44.02 31,44.02 30,42.52 30,40.52 28,38.52 28,38.02 27,37.02 | U5.5 9.2,37.13 v9.38,36.95 | 27,37.02 v26,37.02
I2C_SDA  (via drill 0.5)
  Top 0.254: R8.2 36,48.16 X2.3 | v8,36.02 v27.5,36.02
  Bottom 0.254: X2.3 37.14,47.02 37.14,45.66 34,42.52 31.5,42.52 30.64,41.66 30.64,39.6 30.56,39.52 30,39.52 29,38.02 29,36.02 | U3.3 35,16.34 35,18.02 34.44,18.02 34.44,23.59 31.51,26.52 29,26.52 29,36.02 | 29,36.02 v27.5,36.02 | U5.6 8,38.7 v8,36.02
LORA_CS
  Bottom 0.305: X2.26 62.11,52.53 62.11,49.52 66,49.52 68.5,47.02 68.5,44.52 69.5,43.52 U4.13P 69.5,30.52 77.43,22.59 R14.2
LORA_DIO0
  Bottom 0.254: X2.18 52,52.48 52,48.02 54,48.02 54,44.52 59.5,44.52 59.5,30.02 65.5,30.02 U4.6P
LORA_DIO1
  Bottom 0.254: X2.16 49.4,52.54 49.4,46.02 53.5,46.02 53.5,44.02 59,44.02 59,29.52 63.5,29.52 U4.7P
LORA_DIO2
  Bottom 0.254: X2.15 48.15,45.02 49.5,45.02 49.5,43.52 58.5,43.52 58.5,29.02 61.5,29.02 U4.8P
LORA_RST
  Bottom 0.254: X2.36 72.25,52.49 72.26,52.48 72.26,37.78 71.5,37.02 U4.14P
  Bottom 0.305: R17.2 77,25.02 71.5,30.52 U4.14P
MISO  (via drill 0.6)
  Top 0.305: 64.13,45.42 v64.2,45.42 64.09,45.31 IC1.15
  Bottom 0.305: v64.2,45.42 64.2,45.52 63.5,45.51 | 63.5,45.51 55.8,45.42 55.8,51.05 X2.21 | U4.10P 63.5,39.02 | 63.5,39.02 | 63.5,39.02 63.5,45.51
MOSI  (via drill 0.5)
  Top 0.305: v65.5,38.52 65.5,43.02 | 65.5,43.02 65.5,48.02 64.9,48.62 53.23,48.62 X2.19 | IC1.14 65.5,43.02
  Bottom 0.305: v65.5,38.52 U4.11P
N$1  (via drill 0.6)
  Top 0.406: v37,34.52 v37,26.52
  Bottom 0.406: R3.2 37,38.84 v37,34.52 | v37,26.52 40.37,23.15 46.01,23.15 | R2.2 46.01,22.06 46.01,23.15 | 46.01,23.15 U$1.3
N$2
  Top 0.305: 8MHZ.2 75.8,24.29 75.8,28.64 73.94,28.64 C2.2 72.5,30.62 72.5,29.02 71.5,29.02 71.5,30.52 69.21,30.52 69.21,33.31 IC1.8
N$3
  Top 0.305: 8MHZ.1 60.75,24.29 C1.2 60.75,30.52 67.94,30.52 67.9,30.56 IC1.7
N$4
  Bottom 0.406: R4.1 23.55,50.72 23.55,50.02 | 23.55,50.02 D3.1 | D2.A 20.8,51.02 23.55,50.02
N$5
  Bottom 0.406: U4.1P 75.5,16.02 78.5,13.02 83,11.52 83,10.02 80.5,7.52 48.5,7.52 46.5,9.52 23,9.52 20,12.52 20,21.02 18,23.02 12.5,23.02 12.5,19.52 5.5,19.52 4.5,20.52 J1.P$3
N$7
  Bottom 0.406: U$1.7 47.28,33.19 U$2.1
N$8
  Bottom 0.406: R3.1 43.47,38.84 43.81,39.04 44,39.04 44,39.62
  Bottom 1.422: F5.2 34.81,40.33 36,41.52 39,41.52 C14.1 C8.1 C15.1 44,39.62 U$2.2
N$10
  Top 0.254: J2.2 10.15,25 R60.1
N$11
  Top 0.254: J2.1 13,22.52 19,22.52 19,24.02 R62.1
  Top 0.305: R62.1 32.15,23.67 32.8,23.02 33.3,23.02 33.85,22.47 R59.1 C13.2
N$12
  Top 0.254: R5.2 15.16,33.03 13.54,33.03 Q3.1
N$13
  Top 1.016: F4.1 11,28.52 9.5,30.02 J7.1
N$14
  Top 1.016: J7.2 10.21,33.54 10.69,34.02 Q3.3
N$15
  Bottom 0.254: U5.8 9.18,41.02 R13.2
N$16
  Bottom 0.254: U5.7 7.17,39.35 R12.2
N$17
  Top 0.254: R24.1 68.96,16.64 arc-90 DA2.8
PRE_FUSE_12V
  Top 1.016: F4.2 17,28.52 F3.2
  Bottom 0.254: R19.1 15.5,36.72 15.5,38.52 14.68,39.35 U5.2
  Bottom 1.27: 16,35.52 R19.1
  Bottom 1.676: 49.5,10.02 48.04,11.48 29.5,11.48 29.5,16.52 28,18.02 28,20.52 27.5,21.02 25,21.02 21,25.02 20.04,25.52 F3.2 | 49.5,10.02 49.54,9.98 | F1.1 arc90 56.46,10.02 49.5,10.02
  Bottom 2.184: F3.2 16.84,27.56 16.06,28.34 16.04,33.73 16.04,35.52 16,35.52
PRE_SENSE_12V
  Bottom 0.254: R19.2 13,41.82 13,40.02 11.82,40.02 U5.1
  Bottom 1.27: 16,42.52 R19.2
  Bottom 2.184: 16,42.52 16,43.52 arc90 15.5,44.02 J4.2
RS
  Top 0.305: 61.57,43.2 61.57,43.17 IC1.17
  Top 0.406: 61.57,43.2 61.57,44.52 61,44.52 61,46.97 R1.1
SCK  (via drill 0.5)
  Top 0.305: X2.23 58.31,49.52 65.2,49.52 65.2,49.45 66.63,48.02 IC1.13 66.63,40.06 66.67,40.02 v67.5,40.02
  Bottom 0.305: U4.12P v67.5,40.02
TAMPER  (via drill 0.5)
  Top 0.254: v26.5,32.52 26.5,32.02 28,32.02 29,31.02 29,27.52 30.4,26.12 R61.2
  Bottom 0.254: X2.11 41.79,52.53 41.79,55.06 41.67,55.18 22.16,55.18 19.5,52.52 19.5,51.65 19.18,51.33 19.18,45.7 19.86,45.02 20,45.02 21,44.02 21,39.02 25.5,34.52 26.5,34.52 v26.5,32.52

### Text on the board
_tsilk: GND | 12V | i2c / pullups | R2 | R2 | R1 | R1 | C2 | C1 | FUSE / 2.5A | T4 | MCP2515 | R23 | D4 | FUSE / 500mA | C6 | C6 | 8Mhz crystal | R9 | R5 | R15 | FUSE / 1.35A | R2 | C9 | slope(R22) | FUSE / 1.35A | D2 | SN65HVD | R21 | C1 | C2
_bsilk: 12V | GND | R5 | lora / ant | D7 | T2 | C5 | C5 | C5 | R2 | L1 | R2 | INA219 | 0.1ohm | R3 | C1 | 12V FAN GND / MAX 0.5A | ST1S10 | C11 | C4 | R2 | R18 | RFM69HW | R2 | TAMPER | C2 | C1 | BME280 | D6 | C1 | C8
200bmp: can rpi / header / 2021.06.13 / v1.7